# Altium schematic sheet 01-PowerSupply.SchDoc
size A; DocumentNumber: 2; SheetNumber: 2; SheetTotal: 4
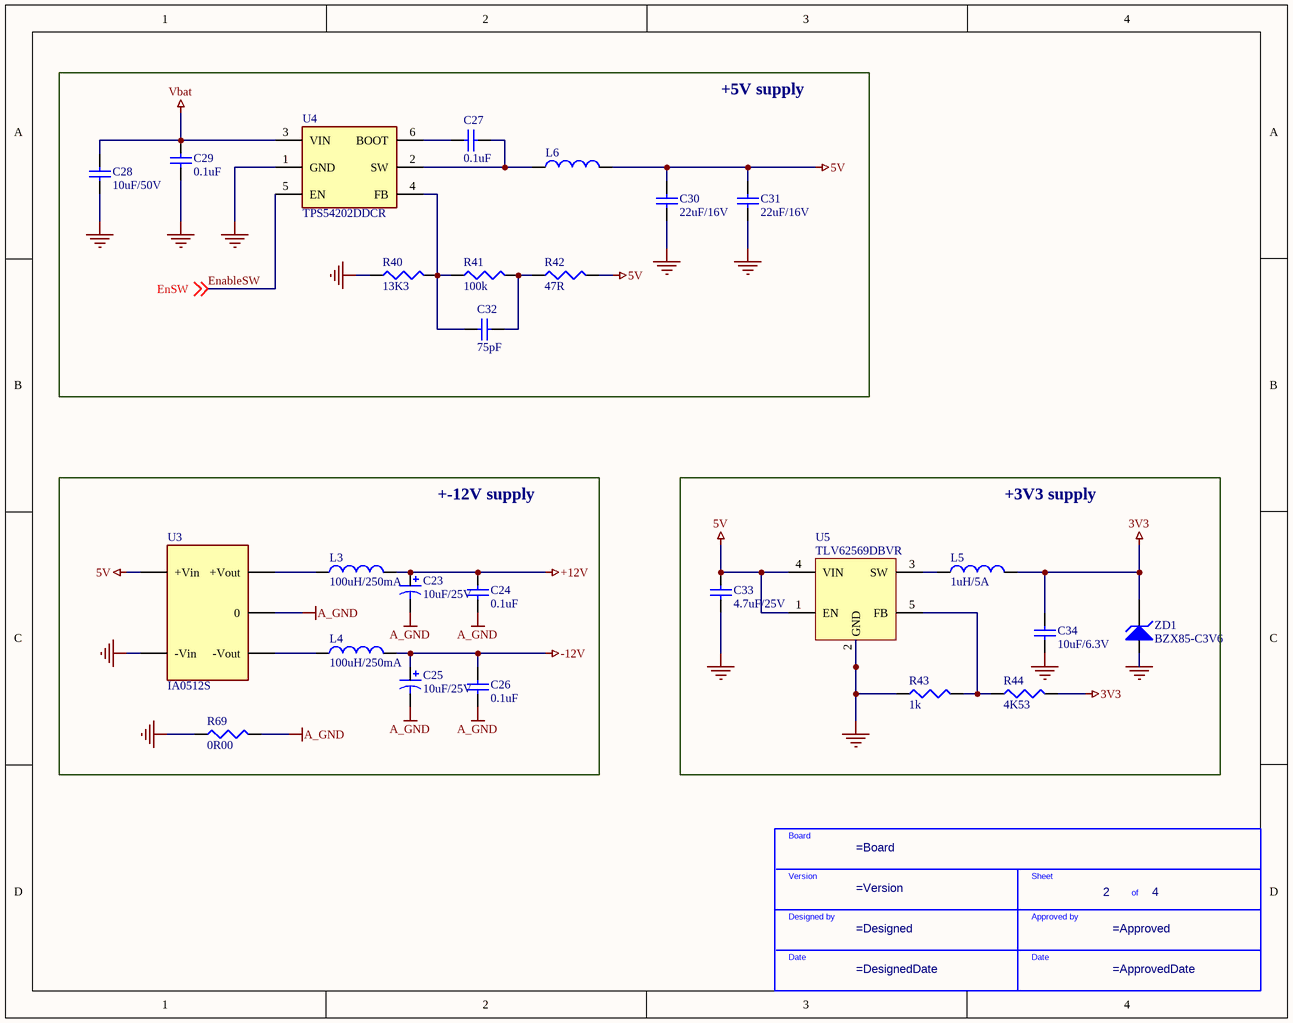
[diagram p0: 01-PowerSupply.SchDoc]

## Parts
C23  10uF/25V  [CAPAED5.0x5.4]
C24  0.1uF  [C0805]
C25  10uF/25V  [CAPAED5.0x5.4]
C26  0.1uF  [C0805]
C27  0.1uF  [C0805]
C28  10uF/50V  [CAPC3426X27N]
C29  0.1uF  [C0805]
C30  22uF/16V  [CAPC3426X27N]
C31  22uF/16V  [CAPC3426X27N]
C32  75pF  [C0805]
C33  4.7uF/25V  [C0805]
C34  10uF/6.3V  [C0805]
L3  100uH/250mA  [L1210]
L4  100uH/250mA  [L1210]
L5  1uH/5A  [I1212]
L6  NR10050T220M  [INDP102100X52N]  (value not drawn)
R40  13K3  [R0805]
R41  100k  [R0805]
R42  47R  [R0805]
R43  1k  [R0805]
R44  4K53  [R0805]
R69  0R00  [R0805]
STB  -  (value not drawn)  (graphical)
U3  IA0512S  [SIP5]
U4  TPS54202DDCR  [SOT23-6]
U5  TLV62569DBVR  [SOT23-5]
ZD1  BZX85-C3V6  [SOD123]

## Blocks framed on the sheet
+5V supply: C27-C32 L6 R40-R42 U4
+-12V supply: C23-C26 L3 L4 R69 U3
+3V3 supply: C33 C34 L5 R43 R44 U5 ZD1

## Nets
3V3: C34.2 L5.2 R44.2 ZD1.C
5V: C30.2 C31.2 C33.2 L6.2 R42.2 U3.+Vin U5.1(EN) U5.4(VIN)
+12V: C23.1 C24.2 L3.2
-12V: C25.1 C26.2 L4.2
A_GND: C23.2 C24.1 C25.2 C26.1 R69.2 U3.0
P_GND: C28.1 C29.1 C30.1 C31.1 C33.1 C34.1 R40.1 R43.1 R69.1 U3.-Vin U4.1(GND) U5.2(GND) ZD1.A
Vbat: C28.2 C29.2 U4.3(VIN)
EnableSW: U4.5(EN) ; off-sheet EnSW  [also labelled EnSW]
NetC27_1: C27.1 L6.1 U4.2(SW)
NetC27_2: C27.2 U4.6(BOOT)
NetC32_1: C32.1 R40.2 R41.1 U4.4(FB)
NetC32_2: C32.2 R41.2 R42.1
NetL3_1: L3.1 U3.+Vout
NetL4_1: L4.1 U3.-Vout
NetL5_1: L5.1 U5.3(SW)
NetR43_2: R43.2 R44.1 U5.5(FB)

## Notes on the sheet
- (in symbol Schematic Title Block) Board; Version; Sheet; of; Designed by; Approved by; Date

## Library data of the parts
C23 C25 = EEE-1EA100SR: CAP 10UF ELEC RAD 25V; Manufacturer: Panasonic Electronic Components; Capacitance: 10µF; Tolerance: ±20%; Lifetime @ Temp.: 2000 Hrs @ 85°C; Polarization: Polar; Ripple Current: 28mA @ 120Hz; Surface Mount Land Size: 0.209" L x 0.209" W (5.30mm x 5.30mm); Type: SMD; .PCBChecked: BP; Manufacturer Part Number: EEE-1EA100SR; RoHS: RoHS Compliant; Category: Capacitors; Packaging: Cut Tape (CT); Part Status: Active; Voltage Rating: 25V; ESR (Equivalent Series Resistance): -; Operating Temperature: -40°C ~ 85°C; Applications: General Purpose; Impedance: -; Lead Spacing: -; Size / Dimension: 0.197" Dia (5.00mm); Height - Seated (Max): 0.213" (5.40mm); Mounting Type: Surface Mount; Package: CAPAE530X610; ComponentLink1URL: https://industrial.panasonic.com/cdbs/www-data/pdf/RDE0000/ABA0000C1145.pdf; ComponentLink1Description: Datasheet; .SCHChecked: BP; Supplier 1: Avnet Abacus; Supplier Part Number 1: EEE1EA100SR
C24 C26 C27 C29 = 08055C104KAT2A: CAP 0.1uF 0805 50V; Manufacturer: KEMET; Ceramic Capacitor Case: 0805 [2012 Metric]; Capacitance: 0.1; Voltage Rating: 50; Capacitance Tolerance: ± 10%; Dielectric Characteristic: X7; SVHC: No SVHC (17-Dec-2015); Capacitance Tolerance +: 10%; Capacitor Terminals: SMD; External Depth: 0.95; External Length / Height: 2; External Width: 1.25; Insulation Resistance: 100000; Reel Quantity: 3000; Voltage Rating V DC: 50V<!--FANDB--><div class="features-and-benefits-container"><div class="features-and-benefits-description"><span class="features-benefits-value">The AVX multilayer ceramic capacitors with EIA class II, X7R dielectric material are temperature stable ceramic chip capacitors. This multilayer ceramic capacitor is a monolithic block of ceramic containing two sets of offset, interleaved planar electrodes that extend to two opposite surfaces of ceramic dielectric. Capacitance for X7R dielectric varies under influence of electrical operating conditions such as voltage and frequency. X7R dielectric chip usage covers broad spectrum of industrial applications where known changes in capacitance due to applied voltages are acceptable.</span></div><div class="features-and-benefits-list"><ul class="features-and-benefits-list-list"><li class="features-and-benefits-list-item">Capacitance value ranges from 100pF to 100?F</li><li class="features-and-benefits-list-item">EIA 0101, 0201, 0402, 0603, 0805, 1206, 1210, 1812, 1825, 2220, 2225 case sizes available</li><li class="features-and-benefits-list-item">Rated DC voltage of 4V, 6.3V, 10V, 16V, 25V, 50V, 100V, 200V, 500V</li><li class="features-and-benefits-list-item">±5%, ±10% and ±20% tolerance</li><li class="features-and-benefits-list-item">Available in FLEXITERM/gold/Nickel (Ni) and tin (Sn) plated terminations</li><li class="features-and-benefits-list-item">Load life of 1000h at 125?C</li><li class="features-and-benefits-list-item">Operating temperature range from -55?C to 125; .PCBChecked: BP; Supplier 1: Avnet Abacus; Manufacturer Part Number: 08055C104KAT2A; RoHS: YES; Stock 1: 94357; Pricing 1: 10=0.0194, 100=0.0134, 500=0.0106, 1000=0.0088, 2000=0.0075 (GBP); Product Range: -; Packaging: Cut Tape; Operating Temperature Min: -55; Operating Temperature Max: 125; Automotive Qualification Standard: -; MSL: MSL 1 - Unlimited; Capacitance Tolerance ±: ± 10%; No. of Pins: 2; Operating Temperature Range: -55°C to +125; Tape Width: 8; Tolerance +: 10%; Tolerance -: 10%; ComponentLink1URL: http://www.farnell.com/datasheets/2237835.pdf; ComponentLink1Description: Datasheet; Supplier Part Number 1: C0805C104K5RAC7800; Category: Capacitors; Package: CAPC2012X88N; Type: SMD; .SCHChecked: BP
C28 = UMK325C7106MM-T_1: 10µF ±20% 50V Ceramic Capacitor X7S 1210 (3225 Metric); Manufacturer: Taiyo Yuden; Type: SMD; Manufacturer Part Number: UMK325C7106MM-T; Package: CAPC3225X125N; Category: Capasitor; Max Rated Voltage: 50 V; Dielectric Characteristic: X7S; Supplier1: Digikey; Supplier part number: 587-1818-2-ND; Tolerance: 20%; ComponentLink1Description: Datasheet; ComponentLink1URL: https://media.digikey.com/pdf/Data%20Sheets/Taiyo%20Yuden%20PDFs%20URL%20links/UMK325C7106MM-T.pdf
C30 C31 = GRM32NC81C226KE15L: Multilayer Ceramic Capacitors MLCC - SMD/SMT 1210 22uF 16volts *Derate Voltage/Temp; Manufacturer: Murata; Max Rated Voltage: 16 V; Dielectric Characteristic: X6S; Type: SMD; Tolerance: 10%; Manufacturer Part Number: GRM32NC81C226KE15L; Package: CAPC3225X125N; Category: Capasitor; Supplier1: Mouser; Supplier part number: 81-GRM32NC81C226KE5L; ComponentLink1Description: Datasheet; ComponentLink1URL: https://eu.mouser.com/datasheet/2/281/murata_03052018_GRM_Series_1-1310166.pdf
C32 = CC0805JRNPO9BN750: CAP 75PF 0805 50V; Manufacturer: Yageo; Tolerance: 5%; Dielectric: C0G; Type: SMD; Supplier 1: Mouser; Manufacturer Part Number: CC0805JRNPO9BN750; RoHS: Yes; Stock 1: 9590; Pricing 1: 1 = 0.17000, 10 = 0.08300, 50 = 0.08300, 100 = 0.03700, 1000 = 0.03100, 4000 = 0.02200, 8000 = 0.02100, 10000 = 0.02100, 24000 = 0.02000, 48000 = 0.01900, 100000 = 0.01500 (USD); Mount: Surface Mount; Case/Package: 0805; Weight: 0.000194oz; Case Code (Imperial): 0805; Case Code (Metric): 2012; Min Operating Temperature: -55°C; Max Operating Temperature: 125°C; Capacitance: 75pF; Packaging: Tape and Reel; Voltage Rating (DC): 50V; Termination: SMD/SMT; Composition: Ceramic; Voltage Rating: 50V; Length: 0.079inch; Width: 0.049inch; Thickness: 0.028inch; ComponentLink1URL: http://www.mouser.com/ds/2/447/Yageo_UPY-GP_NP0_16V-to-50V_9-358835.pdf?src-supplier=Mouser; ComponentLink1Description: Datasheet; Supplier Part Number 1: 603-CC805JRNPO9BN750; Package: CAPC2012X88N
C33 = CL21A475KAQNNNE: CAP 4.7UF 0805 25V; Manufacturer: Samsung; Tolerance: 10%; Dielectric: X5R; Type: SMD; Supplier 1: Digi-Key; Manufacturer Part Number: CL21A475KAQNNNE; Stock 1: 507830; Pricing 1: 1=0.19000, 10=0.12900, 100=0.06550, 500=0.04482, 1000=0.03965 (USD); RoHS: Yes; Mount: Surface Mount; Case/Package: 0805; Case Code (Metric): 2012; Case Code (Imperial): 0805; Min Operating Temperature: -55°C; Max Operating Temperature: 85°C; Package Quantity: 1; Packaging: Tape and Reel; Capacitance: 4.7uF; Voltage Rating: 25V; Voltage Rating (DC): 25V; Length: 2mm; Height: 1.25mm; Width: 0.049inch; Thickness: 0.055inch; Depth: 1.25mm; Radiation Hardening: No; Lead Free: Lead Free; ComponentLink1URL: https://datasheet.ciiva.com/25798/cl21a475kaqnnne-25798882.pdf?src-supplier=Digi-Key; ComponentLink1Description: Datasheet; Supplier Part Number 1: 1276-1244-1-ND; Package: CAPC2012X88N
C34 = JMK212BJ106KD-T: CAP 10UF 0805 6.3V; Manufacturer: Taiyo Yuden; Tolerance: 10%; Dielectric: X5R; Type: SMD; Supplier 1: Mouser; Manufacturer Part Number: JMK212BJ106KD-T; Stock 1: 61344; Pricing 1: 1=0.17000, 10=0.07400, 50=0.07400, 100=0.05000, 500=0.04000, 1000=0.03300, 4000=0.03100, 8000=0.02400, 10000=0.02400, 12000=0.02100, 24000=0.02000 (USD); RoHS: Yes; Mount: Surface Mount; Case/Package: 0805; Number of Pins: 2; Case Code (Metric): 2012; Case Code (Imperial): 0805; Min Operating Temperature: -55°C; Max Operating Temperature: 85°C; Capacitance: 10uF; Packaging: Tape and Reel; Voltage Rating (DC): 6.3V; Voltage Rating: 6.3V; Package Quantity: 1; Termination: SMD/SMT; Composition: Ceramic; Length: 2mm; Height: 0.85mm; Width: 0.049inch; Depth: 1.25mm; Thickness: 0.037inch; Radiation Hardening: No; Lead Free: Lead Free; REACH SVHC: No SVHC; ComponentLink1URL: https://datasheet.ciiva.com/15921/mlcc-all-e-15921049.pdf?src-supplier=Onlinecomponents.com; ComponentLink1Description: Datasheet; Supplier Part Number 1: 963-JMK212BJ106KD-T; Package: CAPC2012X88N
L3 L4 = BRL3225T101K: IND 100UH 1210 250mA; Manufacturer: Taiyo Yuden; Catalog Drawings: BRL3225 Series Side BRL3225 Series End; Featured Product: BRL3225 Series; EDA / CAD Models: Download from Accelerated Designs; Type: SMD; Inductance: 100µH; Tolerance: ±10%; Current - Saturation: 270mA; Shielding: Unshielded; DC Resistance (DCR): 3 Ohm Max; Frequency - Self Resonant: 5MHz; Frequency - Test: 100kHz; Online Catalog: BR Series; Other Names: 587-2170-6; Supplier 1: Mouser; Manufacturer Part Number: BRL3225T101K; Stock 1: 14059; Pricing 1: 1=0.25, 10=0.164, 50=0.164, 100=0.137, 1000=0.098, 10000=0.078 (USD); Standard Package: 1; Category: Inductors, Coils, Chokes; Family: Fixed Inductors; Series: BR; Packaging: Digi-Reel®; Current Rating: 250mA; Operating Temperature: -40°C ~ 105°C; Mounting Type: Surface Mount; Package: INDC3225X170N; Size / Dimension: 0.126" L x 0.098" W (3.20mm x 2.50mm); Height - Seated (Max): 0.067" (1.70mm); ComponentLink1URL: https://datasheet.ciiva.com/7291/brl3225t101k-ss-7291482.pdf; ComponentLink1Description: Datasheet; Supplier Part Number 1: 963-BRL3225T101K
L5 = IHLP1212BZER1R0M11: IND 1UH 5A 24mOhm; Manufacturer: Vishay Dale; Core Material: Metal,Composite; Self Resonant Frequency: 75MHz; Shielding: Shielded; Saturation Current: 4.5A; Tolerance: 20%; DC Resistance (DCR): 24mR; Test Frequency: 100kHz; Type: SMD; Supplier 1: RSComponents; Manufacturer Part Number: IHLP1212BZER1R0M11; Stock 1: 55; RoHS: Yes; Mount: Surface Mount; Case/Package: 1212; Number of Pins: 2; Case Code (Metric): 3630; Case Code (Imperial): 1212; Contact Plating: Tin; Min Operating Temperature: -55°C; Max Operating Temperature: 125°C; Packaging: Tape and Reel; Package Quantity: 3000; Current Rating: 5A; Inductance Tolerance: 20%; Inductance: 1uH; Max DC Current: 5A; RMS Current (Irms): 5A; Military Standard: Not; Length: 3.6mm; Height: 2mm; Width: 0.118inch; Height - Seated (Max): 0.079inch; Depth: 3.2mm; Radiation Hardening: No; REACH SVHC: Unknown; Lead Free: Lead Free; ComponentLink1URL: https://datasheet.ciiva.com/26821/getdatasheetpartid-180380-26821417.pdf?src-supplier=Verical; ComponentLink1Description: Datasheet; Supplier Part Number 1: 7486690; Termination: SMD/SMT; Package: INDC3030X200N
L6 = NR10050T220M: FIXED IND 22UH 2.5A 58.5 MOHM; Manufacturer: Taiyo Yuden; Core Material: Ferrite; Self Resonant Frequency: 10MHz; Shielding: Shielded; Tolerance: 20%; Saturation Current: 2.6A; DC Resistance (DCR): 58.5mR; Test Frequency: 100kHz; Supplier 1: Mouser; Supplier Part Number 1: 963-NR10050T220M; Manufacturer Part Number: NR10050T220M; Stock 1: 680; Pricing 1: 1=0.89, 10=0.677, 100=0.579, 500=0.462, 1000=0.374, 2500=0.352 (USD); Mount: Surface Mount; Case/Package: Nonstandard; Number of Pins: 2; Min Operating Temperature: -25°C; Max Operating Temperature: 105°C; Packaging: Tape and Reel; Current Rating: 2.5A; Inductance: 22uH; Inductance Tolerance: 20%; Package Quantity: 500; Max DC Current: 2.6A; Termination: SMD/SMT; Composition: Wirewound; RMS Current (Irms): 2.5A; Length: 0.394inch; Height: 5mm; Width: 9.8mm; Height - Seated (Max): 0.197inch; Depth: 10.3mm; Radiation Hardening: No; Lead Free: Lead Free; Halogen Free: Halogen Free; REACH SVHC: Unknown; ComponentLink1Description: Datasheet; ComponentLink1URL: https://eu.mouser.com/datasheet/2/396/wound06_e-1313806.pdf
R40 = TNPW080513K3BEEN: RES 13K3 0805 0.125W 0.1%; Manufacturer: Vishay Dale; Resistance: 13.3kR; Power Rating: 125mW; Voltage Rating: 150V; Temperature Coefficient: 25ppm/°C; Voltage Rating (DC): 100V; Supplier 1: Mouser; Manufacturer Part Number: TNPW080513K3BEEN; RoHS: Yes; Stock 1: 757; Pricing 1: 1 = 0.94000, 10 = 0.94000, 50 = 0.75800, 100 = 0.59800, 1000 = 0.38400, 10000 = 0.38400 (USD); Mount: Surface Mount; Case/Package: 0805; Case Code (Metric): 2012; Case Code (Imperial): 0805; Contact Plating: Tin; Min Operating Temperature: -55°C; Max Operating Temperature: 125°C; Tolerance: 0.1%; Packaging: Tape and Reel; Package Quantity: 1000; Composition: Thin Film; Number of Terminations: 2; Termination: SMD/SMT; Military Standard: Not; Max Power Dissipation: 125mW; Features: Moisture Resistant; Length: 2mm; Height: 0.022inch; Width: 0.049inch; Depth: 1.25mm; Radiation Hardening: No; ComponentLink1URL: https://datasheet.ciiva.com/48526/tnpw-e3-48526534.pdf?src-supplier=Avnet; ComponentLink1Description: Datasheet; Supplier Part Number 1: 71-TNPW080513K3BEEN; Type: SMD; Package: RESC2012X60N
R41 = CRCW0805100KFKEA: RES 100K 0805 0.125W 1%; Manufacturer: Vishay; Resistance: 100kR; Temperature Coefficient: 100ppm/°C; Power Rating: 125mW; Voltage Rating: 150V; Supplier 1: Future Electronics; Manufacturer Part Number: CRCW0805100KFKEA; Stock 1: 0; Pricing 1: 5000=0.08 (USD); Mount: Surface Mount; Case/Package: 0805; Number of Pins: 2; Weight: 0.000194oz; Contact Plating: Tin; Case Code (Imperial): 0805; Case Code (Metric): 2012; Min Operating Temperature: -55°C; Max Operating Temperature: 155°C; Tolerance: 1%; Composition: Thick Film; Termination: SMD/SMT; Packaging: Tape and Reel; Package Quantity: 5000; Military Standard: Not; Voltage Rating (DC): 150V; Length: 2mm; Height: 0.45mm; Width: 1.25mm; Depth: 1.25mm; Radiation Hardening: No; Lead Free: Lead Free; REACH SVHC: Unknown; ComponentLink1URL: https://datasheet.ciiva.com/11809/0900766b80d98b26-11809057.pdf; ComponentLink1Description: Datasheet; Supplier Part Number 1: 4264859; Type: SMD; Package: RESC2012X60N
R42 = RC0805FR-0747RL: RC Series 0805 0.125 W 47 Ohm ±1% ±100 ppm/°C SMT Thick Film Chip Resistor; Manufacturer: Yageo; Power rating: 0.125W; Resistance: 24R; Manufacturer Part Number: RC0805FR-0747RL; Package: RESC1608X50N; Category: Resistor; Tolerance: 1%; Number of pins: 2; Type: SMD; Supplier1: Future electronics; Supplier part number: RC0805FR-0747RL; ComponentLink1Description: Datasheet; ComponentLink1URL: https://www.yageo.com/upload/media/product/productsearch/datasheet/rchip/PYu-RC_Group_51_RoHS_L_10.pdf
R43 = CRCW08051K00FKEA: RES 1K 0805 0.125W 1%; Manufacturer: Vishay Dale; Power (Watts): 0.125W, 1/8W; Temperature Coefficient: ±100ppm/°C; .PCBChecked: BP; Supplier 1: Avnet Abacus; Manufacturer Part Number: CRCW08051K00FKEA; RoHS: RoHS Compliant; Category: Resistors; Stock 1: 528553; Pricing 1: 1=0.1, 10=0.042, 25=0.0304, 50=0.0232, 100=0.017, 250=0.013, 500=0.0104, 1000=0.00765 (USD); Packaging: Cut Tape (CT); Part Status: Active; Resistance (Ohms): 1k; Tolerance: ±1%; Composition: Thick Film; Features: Automotive AEC-Q200; Operating Temperature: -55°C ~ 155°C; Package: RESC2012X60N; Supplier Device Package: 0805; Size / Dimension: 0.079" L x 0.049" W (2.00mm x 1.25mm); Height - Seated (Max): 0.020" (0.50mm); Failure Rate: -; ComponentLink1URL: http://www.vishay.com/docs/20035/dcrcwe3.pdf; ComponentLink1Description: Datasheet; Supplier Part Number 1: CRCW08051K00FKEA; Type: SMD; .SCHChecked: BP
R44 = CRCW08054K53FKEA: RES 4K53 0805 0.125W 1%; Manufacturer: Vishay; Power Rating: 125mW; Resistance: 4.53kR; Voltage Rating: 150V; Temperature Coefficient: 100ppm/°C; Supplier 1: RSComponents; Manufacturer Part Number: CRCW08054K53FKEA; Stock 1: 6000; RoHS: Yes; Case/Package: 0805; Number of Pins: 2; Weight: 0.000194oz; Contact Plating: Tin; Case Code (Metric): 2012; Case Code (Imperial): 0805; Min Operating Temperature: -55°C; Max Operating Temperature: 155°C; Package Quantity: 10; Packaging: Tape and Reel; Max Power Dissipation: 125mW; Tolerance: 1%; Composition: Thick Film; Number of Terminations: 2; Termination: SMD/SMT; Military Standard: Not; Voltage Rating (DC): 150V; Features: Automotive AEC-Q200; Length: 2mm; Height: 0.45mm; Width: 0.049inch; Depth: 1.25mm; Radiation Hardening: No; REACH SVHC: Unknown; Lead Free: Lead Free; ComponentLink1URL: https://datasheet.ciiva.com/11810/0900766b80d98b26-11810011.pdf?src-supplier=RSComponents; ComponentLink1Description: Datasheet; Supplier Part Number 1: 6791484; Type: SMD; Package: RESC2012X60N
R69 = RC0805FR-070RL: Res Thick Film 0805 0 Ohm Jumper Molded SMD Paper T/R; Manufacturer: Yageo; Power rating: 0.125 W; Tolerance: 1%; Manufacturer Part Number: RC0805FR-070RL; Package: RESC2012X60N; Category: Resistor; Resistance: 0R00; Number of pins: 2; Type: SMD; Supplier1: Avnet abacus; Supplier part number: RC0805FR-070RL; ComponentLink1Description: Datasheet; ComponentLink1URL: https://www.yageo.com/documents/recent/PYu-RC_Group_51_RoHS_L_2.pdf
STB = Schematic Title Block: Schematic Title Block Template
U3 = IA0512S: DC/DC 5V +/-12V SIP5 1W; Manufacturer: XP Power; DC / DC Converter Output Type: Fixed; No. of Outputs: 2 Output; Input Voltage DC Min: 4.5V; Input Voltage DC Max: 5.5V; Output Voltage - Output 1: 12V; Output Voltage - Output 2: -12V; Output Current - Output 1: 42mA; DC / DC Converter Type: SIP; DC / DC Converter Mounting: Through Hole; Product Range: IA Series; SVHC: To Be Advised; Supplier 1: Farnell; Manufacturer Part Number: IA0512S; Stock 1: 341; Pricing 1: 1=4.24, 5=4.11, 10=3.99 (EUR); Output Power Max: 1W; Output Current - Output 2: 42mA; Approvals & Standards: -; Width: 6.09mm; Height: 10.16mm; Depth: 19.3mm; Output Voltage - Output 3: -; Output Current - Output 3: -; ComponentLink1URL: https://datasheet.ciiva.com/29378/sf-ia-29378232.pdf; ComponentLink1Description: Datasheet; Supplier Part Number 1: 8727503; Type: THT; Case: SIP5
U4 = TPS54202DDCR: IC REG BUCK ADJ 2A SYNC SOT23-6; Manufacturer: Texas Instruments; Number of Outputs: 1; Min Input Voltage: 4.5V; Max Input Voltage: 28V; Min Output Voltage: 596mV; Switching Frequency: 500kHz; Synchronous Rectifier: Yes; Quiescent Current: 40uA; Output Type: Adjustable; Output Configuration: Positive; Supplier 1: Mouser; Manufacturer Part Number: TPS54202DDCR; RoHS: Yes; Stock 1: 34946; Pricing 1: 1 = 1.68000, 10 = 1.43000, 50 = 1.43000, 100 = 1.15000, 1000 = 0.83000, 10000 = 0.71500 (USD); Mount: Surface Mount; Case/Package: SOT-23-6; Min Operating Temperature: -40°C; Max Operating Temperature: 125°C; Packaging: Tape and Reel; Max Output Voltage: 28V; Output Current: 2A; Lead Free: Lead Free; ComponentLink1URL: http://www.ti.com/lit/ds/symlink/tps54202.pdf?src-supplier=Digi-Key; ComponentLink1Description: Datasheet; Supplier Part Number 1: 595-TPS54202DDCR; Type: SMD; Package: SOT95P245X110-6N
U5 = TLV62569DBVR: IC REG BUCK ADJ 2A SOT23-5; Manufacturer: Texas Instruments; Supplier 1: Mouser; Manufacturer Part Number: TLV62569DBVR; Stock 1: 3906; Pricing 1: 1=1.27000, 10=1.08000, 50=1.08000, 100=0.83300, 500=0.73600, 1000=0.58100, 3000=0.51500, 9000=0.49600, 10000=0.49600, 24000=0.48000, 45000=0.46500 (USD); RoHS: No; Case/Package: SOT-23-5; Min Operating Temperature: -40°C; Max Operating Temperature: 125°C; ComponentLink1URL: http://www.ti.com/lit/ds/symlink/tlv62569.pdf?src-supplier=Farnell; ComponentLink1Description: Datasheet; Supplier Part Number 1: 595-TLV62569DBVR; Type: SMD; Package: SOT95P245X110-5N
ZD1 = BZX85-C3V6: ZENER 3.6V SOD123 1.3W; Manufacturer: NEXPERIA; .PCBChecked: BP; Manufacturer Part Number: BZX85-C3V6; RoHS: YES; ComponentLink1URL: http://www.farnell.com/datasheets/2246285.pdf; ComponentLink1Description: Datasheet; Category: Diodes; Package: SOD3716X135N; Type: SMD; .SCHChecked: BP; Supplier 1: Farnell; Supplier Part Number 1: 1907624